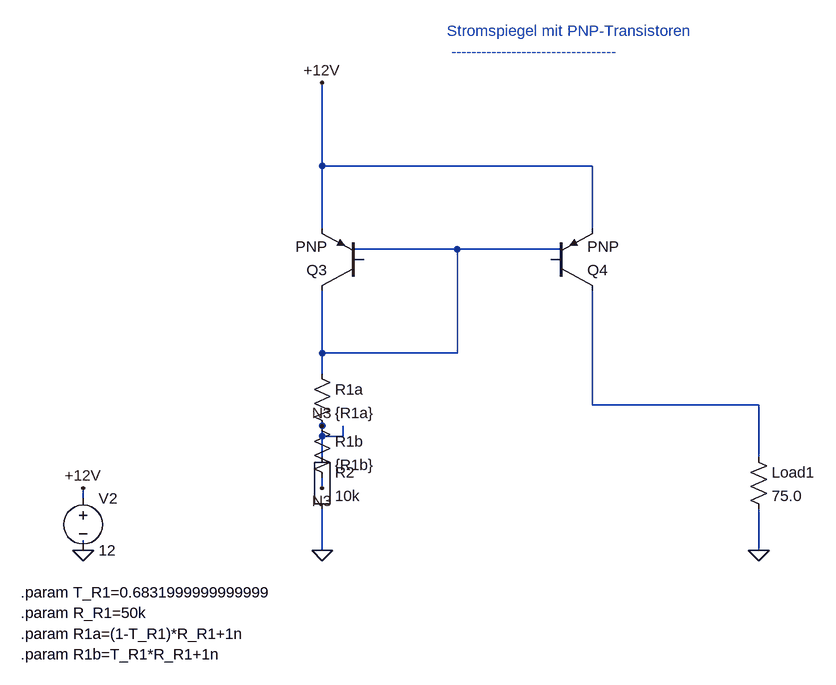
[diagram p0: schematic Stromspiegel_mit_BJT.asc]
Stromspiegel_mit_BJT.asc, the LTspice schematic file:
Version 4
SHEET 1 880 680
WIRE 592 464 576 464
WIRE 576 464 576 448
WIRE 528 416 528 384
WIRE 880 464 896 464
WIRE 896 464 896 448
WIRE 944 416 944 384
WIRE 160 912 160 896
WIRE 896 448 736 448
WIRE 160 816 160 832
WIRE 528 720 528 736
WIRE 528 640 528 608
WIRE 1200 912 1200 848
WIRE 560 720 560 736
WIRE 560 736 528 736
WIRE 528 736 528 768
WIRE 528 848 528 912
WIRE 528 608 528 512
WIRE 736 448 576 448
WIRE 528 608 736 608
WIRE 736 608 736 448
WIRE 1200 768 1200 688
WIRE 1200 688 944 688
WIRE 944 688 944 512
WIRE 944 384 944 320
WIRE 944 320 528 320
WIRE 528 320 528 384
WIRE 528 192 528 320
WIRE 528 800 528 816
FLAG 160 912 0
FLAG 528 912 0
FLAG 1200 912 0
FLAG 160 912 0
FLAG 528 912 0
FLAG 1200 912 0
FLAG 528 816 N3
FLAG 528 720 N3
FLAG 528 192 +12V
FLAG 160 816 +12V
SYMBOL pnp 592 512 R180
SYMATTR InstName Q3
SYMATTR Value PNP
SYMBOL pnp 880 512 M180
SYMATTR InstName Q4
SYMATTR Value PNP
SYMBOL voltage 160 816 R0
SYMATTR InstName V2
SYMATTR Value 12
SYMBOL res 512 624 R0
SYMATTR InstName R1a
SYMATTR Value {R1a}
SYMBOL res 512 704 R0
SYMATTR InstName R1b
SYMATTR Value {R1b}
SYMBOL res 1184 752 R0
SYMATTR InstName Load1
SYMATTR Value 75.0
SYMBOL Misc\EuropeanResistor 512 752 R0
SYMATTR InstName R2
SYMATTR Value 10k
TEXT 64 976 Left 2 !.param T_R1=0.6831999999999999
TEXT 64 1008 Left 2 !.param R_R1=50k
TEXT 64 1040 Left 2 !.param R1a=(1-T_R1)*R_R1+1n
TEXT 64 1072 Left 2 !.param R1b=T_R1*R_R1+1n
TEXT 720 112 Left 2 ;Stromspiegel mit PNP-Transistoren \n ---------------------------------

The netlist it stands for:
* Stromspiegel_mit_BJT.asc
Q3 N001 N001 +12V 0 PNP
Q4 N002 N001 +12V 0 PNP
V2 +12V 0 12
R1a N001 N3 {R1a}
R1b N3 N3 {R1b}
R§Load1 N002 0 75.0
R2 N3 0 10k
.model NPN NPN
.model PNP PNP
.lib standard.bjt
.param T_R1=0.6831999999999999
.param R_R1=50k
.param R1a=(1-T_R1)*R_R1+1n
.param R1b=T_R1*R_R1+1n
* Stromspiegel mit PNP-Transistoren
*  ---------------------------------
.backanno
.end